# Altium project esp32_lcd.PrjPcb
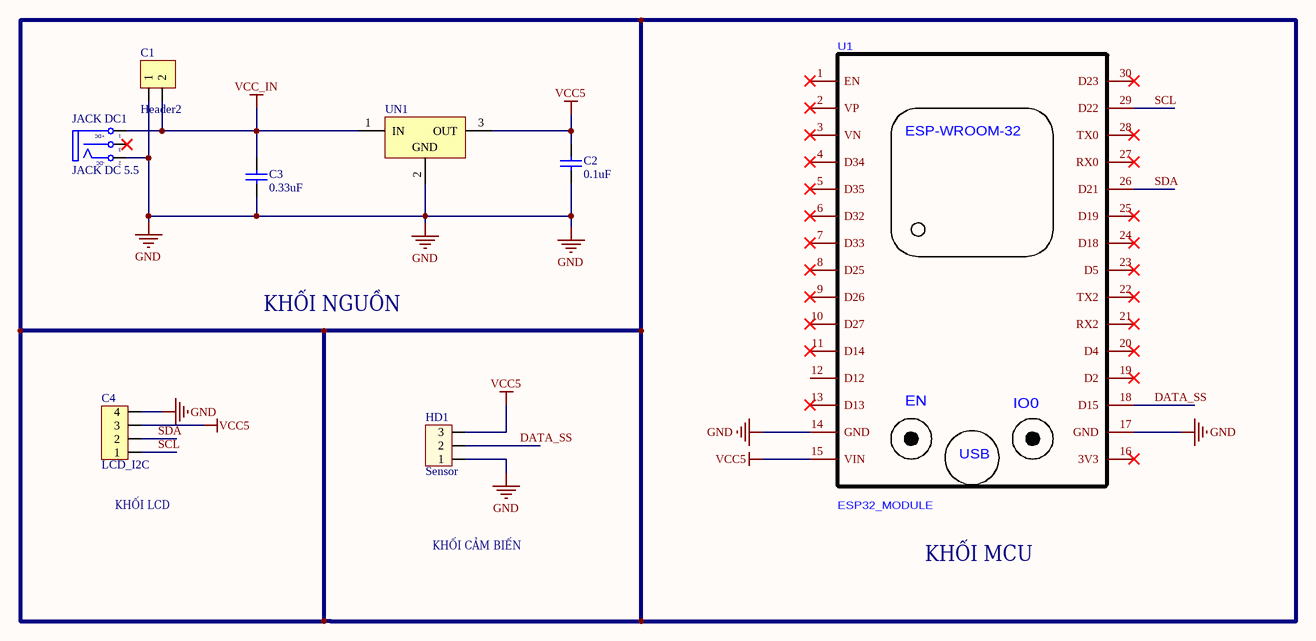
[diagram p0: Sheet1.SchDoc]
1 sheet, 8 parts. Net scope: global (net labels, ports and power ports of the same name join across sheets).
Board file: PCB1.PcbDoc

## Sheet Sheet1.SchDoc
size A3; SheetNumber: 1; SheetTotal: 1

### Parts
C1  Header2  [Header2]
C2  0.1uF  [tu gom]
C3  0.33uF  [tu gom]
C4  LCD_I2C  [Header4]
HD1  Sensor  [HED3]
JACK_DC1  JACK DC 5.5  [JACK DC 5.5]
U1  ESP32_MODULE  [ESP32-WIFIMODULE-FOOTPRINT]
UN1  L78M05CP  [QTO-220H2]  (value not drawn)

### Nets
GND: C1.1 C2.2 C3.2 C4.4 HD1.1 JACK_DC1.2(TN) U1.14(GND) U1.17(GND) UN1.2(GND)
VCC5: C2.1 C4.3 HD1.3 U1.15(VIN) UN1.3(OUT)
VCC_IN: C1.2 C3.1 JACK_DC1.1(T) UN1.1(IN)
DATA_SS: HD1.2 U1.18(D15)
SCL: C4.1 U1.29(D22)
SDA: C4.2 U1.26(D21)

Not connected (* = marked no-connect by the designer): JACK_DC1 3(S)*; U1 1(EN)* 2(VP)* 3(VN)* 4(D34)* 5(D35)* 6(D32)* 7(D33)* 8(D25)* 9(D26)* 10(D27)* 11(D14)* 12(D12) 13(D13)* 16(3V3)* 19(D2)* 20(D4)* 21(RX2)* 22(TX2)* 23(D5)* 24(D18)* 25(D19)* 27(RX0)* 28(TX0)* 30(D23)*

### Notes on the sheet
- KHỐI NGUỒN
- (near C4) KHỐI LCD
- KHỐI CẢM BIẾN
- KHỐI MCU
- (in symbol ESP32_MODULE copy) ESP-WROOM-32; IO0; USB
- (in symbol JACK DC 5.5) +DC; -DC

### Library data of the parts
C1 = Header2: Header IDC, 2 x 1 Pin Vertical 2.54mm Pitch (Non-Boxed, Male); Manufacturer: W¨¹rth Elektronik eiSos GmbH; partNo: 613002143121; ComponentLink1 Description: Manufacturer; ComponentLink2 Description: Datasheet; NoPins: 02; Created Date: 29 March 2013; ComponentLink1URL: http://www.we-online.com; ComponentLink2URL: http://katalog.we-online.de/em/datasheet/6130xx143121.pdf; Created by: Karrer Zheng
C2 C3 = Tu gom 104 50V: Cắm; So_Chan: 2; Ten_Linh_Kien: Tụ gốm 104 100nF 50V; Don_Vi: Con; Ma_Hang: MH004761; Chung_Loai: Cắm; Kieu_Chan: *
C4 = Header4: Header IDC, 4 x 1 Pin Vertical 2.54mm Pitch (Non-Boxed, Male); Manufacturer: W¨¹rth Elektronik eiSos GmbH; partNo: 613002143121; ComponentLink1 Description: Manufacturer; ComponentLink2 Description: Datasheet; NoPins: 02; Created Date: 29 March 2013; ComponentLink1URL: http://www.we-online.com; ComponentLink2URL: http://katalog.we-online.de/em/datasheet/6130xx143121.pdf; Created by: Karrer Zheng
HD1 = Hed3: Header 3 (Green); Value: Header 3
JACK_DC1 = JACK DC 5.5: Value: Jac DC
U1 = ESP32_MODULE copy
UN1 = L78M05CP: Positive Voltage Regulator; Note: Tab is connected to pin 3 (GND).; Published: 24-Aug-2001; LatestRevisionDate: 17-Jul-2002; LatestRevisionNote: Re-released for DXP Platform.; DatasheetVersion: Apr-1994; PackageVersion: Jul-1998; PackageReference: ISOWATT220AB; Publisher: Altium Limited; PackageDescription: TO, Thru-Hole, Vertical, Heatsink Mounted; 3 In-Line Leads; Pitch 2.54 mm; Pin sequence 1, 3, 2; ComponentLink1Description: Manufacturer Link; ComponentLink1URL: http://www.st.com/; ComponentLink2Description: Datasheet; ComponentLink2URL: http://www.st.com/stonline/products/literature/ds/2146/l78m05c.pdf